# EAGLE design Adafruit BNO055 (EAGLE 9.3.1)
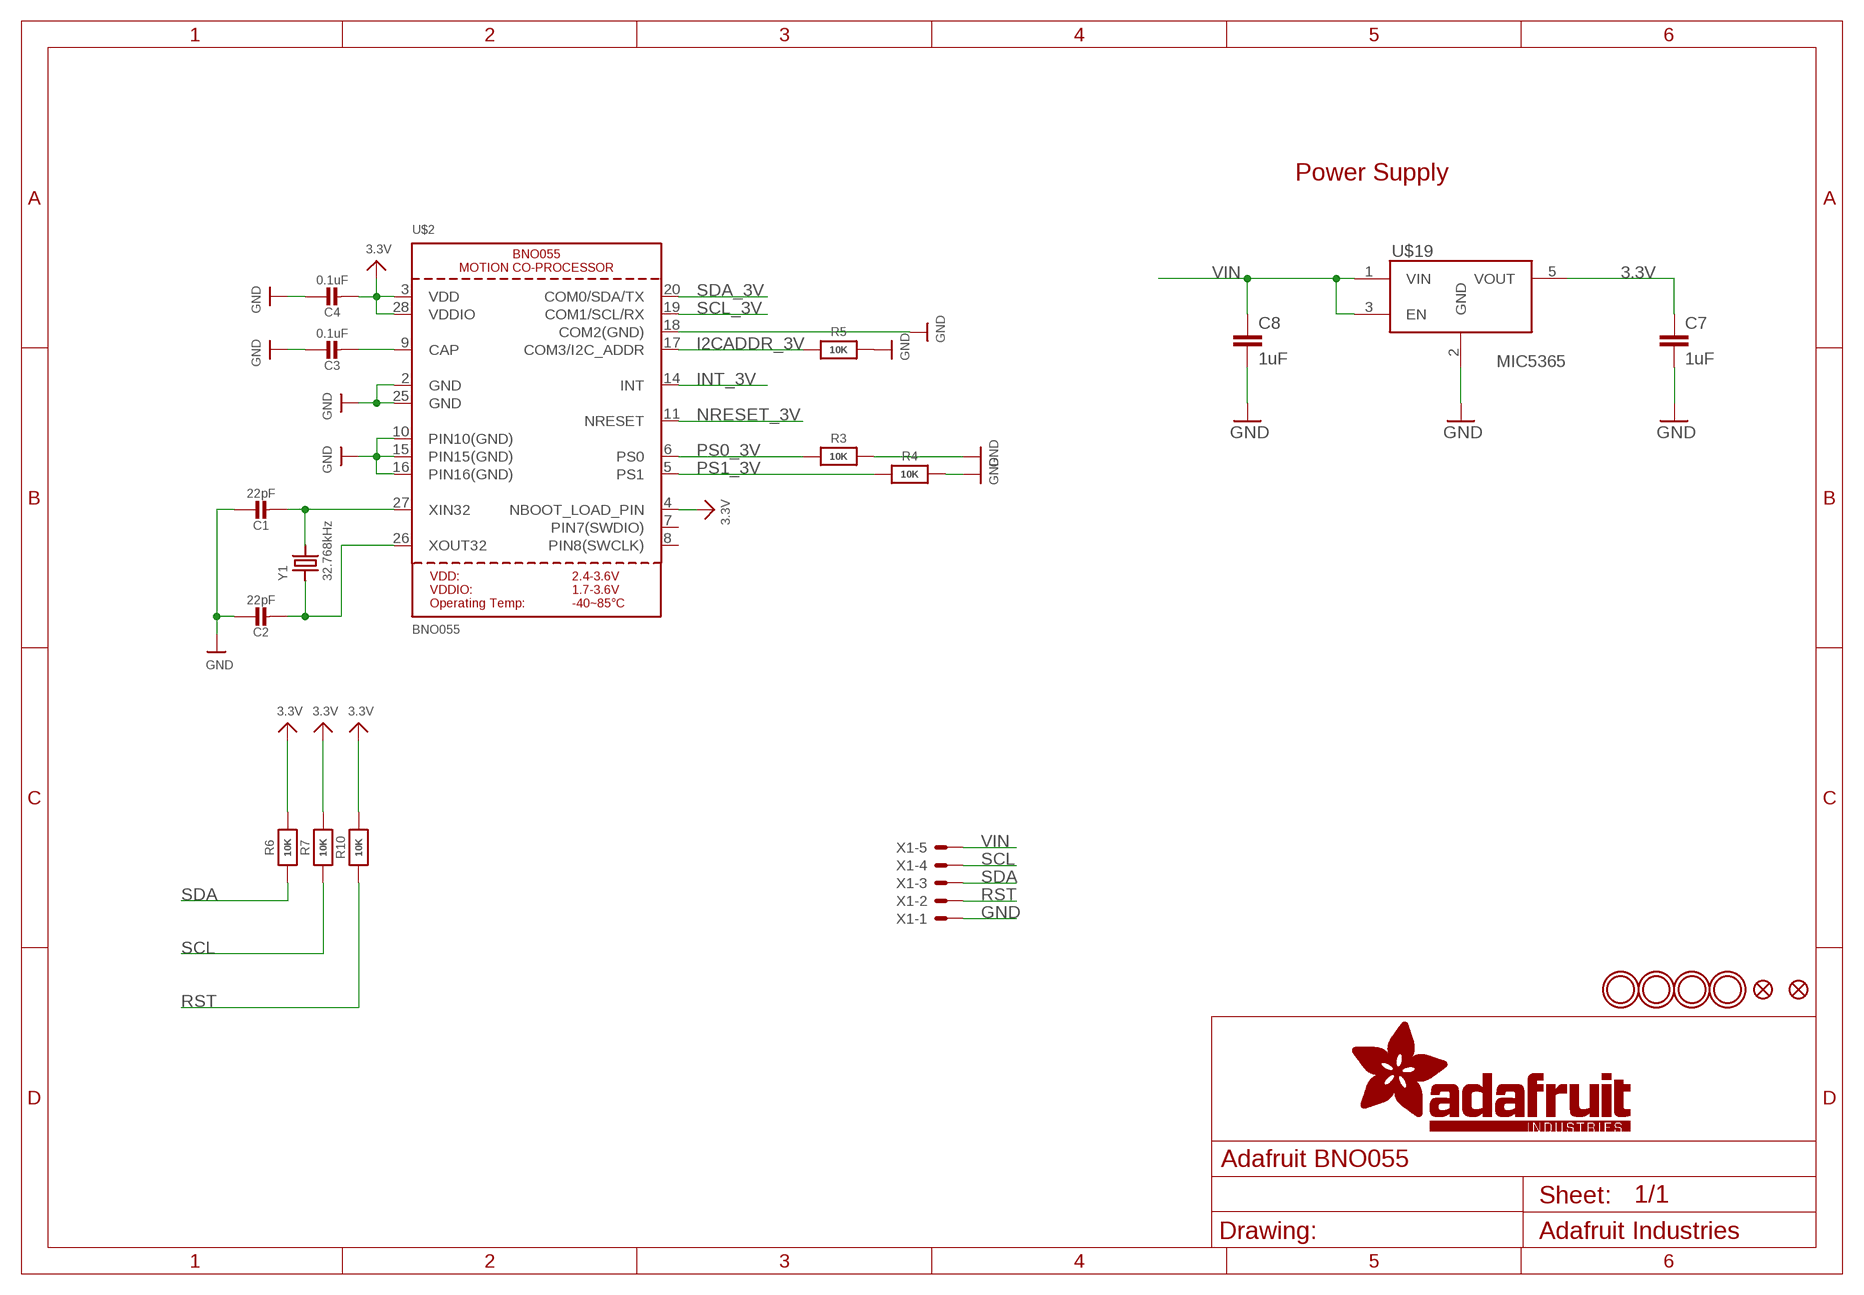
[diagram p0: schematic, sheet 1]

## Parts
C1  22pF  CAP_CERAMIC0805-NOOUTLINE  [0805-NO]
C2  22pF  CAP_CERAMIC0805-NOOUTLINE  [0805-NO]
C3  0.1uF  CAP_CERAMIC0805-NOOUTLINE  [0805-NO]
C4  0.1uF  CAP_CERAMIC0805_10MGAP  [0805_10MGAP]
C7  1uF  C-EUC0402  [C0402]
C8  1uF  C-EUC0402  [C0402]
FID1  FIDUCIAL""  [FIDUCIAL_1MM]
FID2  FIDUCIAL""  [FIDUCIAL_1MM]
R3  10K  RESISTOR0805_NOOUTLINE  [0805-NO]
R4  10K  RESISTOR0805_NOOUTLINE  [0805-NO]
R5  10K  RESISTOR0805_NOOUTLINE  [0805-NO]
R6  10K  RESISTOR0805_NOOUTLINE  [0805-NO]
R7  10K  RESISTOR0805_NOOUTLINE  [0805-NO]
R10  10K  RESISTOR0805_NOOUTLINE  [0805-NO]
U$2  BNO055  [BNO055]
U$19  VREG-MIC5365  [SC70-5L]
U$29  MOUNTINGHOLE2.5_THICK  [MOUNTINGHOLE_2.5_PLATED_THICK]
U$30  MOUNTINGHOLE2.5_THICK  [MOUNTINGHOLE_2.5_PLATED_THICK]
U$31  MOUNTINGHOLE2.5_THICK  [MOUNTINGHOLE_2.5_PLATED_THICK]
U$32  MOUNTINGHOLE2.5_THICK  [MOUNTINGHOLE_2.5_PLATED_THICK]
X1  JST-XH-05-PIN-LONG-PAD  [JST-XH-05-PACKAGE-LONG-PAD]
Y1  32.768kHz  CRYSTAL8.0X3.8  [CRYSTAL_8X3.8]

## Nets
3.3V: C4.2 C7.1 R6.2 R7.2 R10.2 U$2.3(VDD) U$2.4(NBOOT_LOAD_PIN) U$2.28(VDDIO) U$19.5(VOUT)
GND: C1.1 C2.1 C3.1 C4.1 C7.2 C8.2 R3.2 R4.2 R5.2 U$2.2(GND) U$2.10(PIN10(GND)) U$2.15(PIN15(GND)) U$2.16(PIN16(GND)) U$2.18(COM2(GND)) U$2.25(GND) U$19.2(GND) X1.1
I2CADDR_3V: R5.1 U$2.17(COM3/I2C_ADDR)
INT_3V: U$2.14(INT)
N$1: C1.2 U$2.27(XIN32) Y1.P$4
N$2: C2.2 U$2.26(XOUT32) Y1.P$1
N$3: C3.2 U$2.9(CAP)
NRESET_3V: U$2.11(NRESET)
PS0_3V: R3.1 U$2.6(PS0)
PS1_3V: R4.1 U$2.5(PS1)
RST: R10.1 X1.2
SCL: R7.1 X1.4
SCL_3V: U$2.19(COM1/SCL/RX)
SDA: R6.1 X1.3
SDA_3V: U$2.20(COM0/SDA/TX)
VIN: C8.1 U$19.1(VIN) U$19.3(EN) X1.5
Unconnected: U$2.7(PIN7(SWDIO)) U$2.8(PIN8(SWCLK))

## Notes on the sheet
- Power Supply
- MIC5365

## Library data of the parts
C1-C4 = microbuilder:CAP_CERAMIC: Ceramic Capacitors For new designs, use the packages preceded by an '_' character since they are more reliable: The following footprints should be used on most boards: _0402 - Standard footprint for regular board layouts _0603 - Standard footprint for regular board layouts _0805 - Standard footprint for regular board layouts _1206 - Standard footprint for regular board layouts For extremely tight-pitch boards where space is at a premium, the following 'micro-pitch' footprints can be used (smaller pads, no silkscreen outline, etc.): _0402MP - Micro-pitch footprint for very dense/compact boards _0603MP - Micro-pitch footprint for very dense/compact boards _0805MP - Micro-pitch footprint for very dense/compact boards _1206MP - Micro-pitch footprint for very dense/compact boards
C7 C8 = resistor:C-EU: CAPACITOR, European symbol
FID1 FID2 = microbuilder:FIDUCIAL: Fiducial Alignment Points Various fiducial points for machine vision alignment.; BOM: EXCLUDE
R3-R7 R10 = microbuilder:RESISTOR: Resistors For new designs, use the packages preceded by an '_' character since they are more reliable: The following footprints should be used on most boards: _0402 - Standard footprint for regular board layouts _0603 - Standard footprint for regular board layouts _0805 - Standard footprint for regular board layouts _1206 - Standard footprint for regular board layouts For extremely tight-pitch boards where space is at a premium, the following 'micro-pitch' footprints can be used (smaller pads, no silkscreen outline, etc.): _0402MP - Micro-pitch footprint for very dense/compact boards _0603MP - Micro-pitch footprint for very dense/compact boards _0805MP - Micro-pitch footprint for very dense/compact boards _1206MP - Micro-pitch footprint for very dense/compact boards
U$2 = microbuilder:BNO055: BNO055 - Motion Co-Processor
U$19 = BlueRobotics-Main:VREG-MIC5365
U$29-U$32 = microbuilder:MOUNTINGHOLE: Mounting Hole For #2 screws (0.086"/2.18mm width, 0.094"/2.4mm hole) use 2.5mm; BOM: EXCLUDE
X1 = Rembrandt Electronics - JST XH Connectors v1-0:JST-XH-05-PIN: JST XH Connector 2 Pin Wire to board connector. Pitch: 2,54 mm, (0.100") Number of pins: 5 Created by Rembrandt Electronics www.rembrandtelectronics.com
Y1 = microbuilder:CRYSTAL: Crystals HC49UP - Surface Mount Crystal 4.0MHz 18pF +/-30ppm Surface Mount Crystal [Digikey: 535-9857-1-ND] 12.0 MHz Surface Mount Crystal [Digikey: 535-9869-6-ND] 25.0 MHz Surface Mount Crystal [Digikey: 535-9078-1-ND] 2.5 x 2.0mm - MEMs SMT Crystal 16.0 MHz 10pF 20ppm 2.5 x 2.0mm Crystal [Digikey -40-85°C: 535-10923-1-ND] 3.2 x 2.5mm - MEMs SMT Crystal 12.0 MHz 8pF 15ppm 3.2 x 2.5mm Crystal [Digikey: -10-70°C: 644-1047-1-ND -40-125°C: 644-1128-1-ND] 40~85°C cheaper: 644-1173-6-ND 16.0 MHz 8pF 15ppm 3.2 x 2.5mm Crystal [Digikey: -10-70°C: 644-1049-1-ND -40-125°C: 644-1129-2-ND]-40~85°C cheaper: 644-1175-6-ND 16.0 MHz 10pF 10ppm 3.2 x 2.5mm Crystal [Digikey: 644-1100-1-ND] 27.12 MHz 18pF 30ppm 3.2 x 2.5mm Crystal [Digikey: 887-1424-1-ND] 27.12MHz 10pF 10ppm 3.2 x 2.5mm Crystal [Digikey: 887-1329-1-ND] 4.9 x 1.8mm - MEMs SMT Crystal 32.768 KHz 12.5pF 20ppm 4.9 x 1.8mm Crystal [Digikey: SE2415CT-ND] 8.0 x 3.8mm - Surface Mount Crystal 32.768kHz 12.5pF 20ppm -40°C-85°C [Digikey: 535-9166-2-ND] Cylinder 32.768KHz Cylinder Crystal (2x6mm body) [Ex. Digikey: 300-8341-2-ND]

## Board
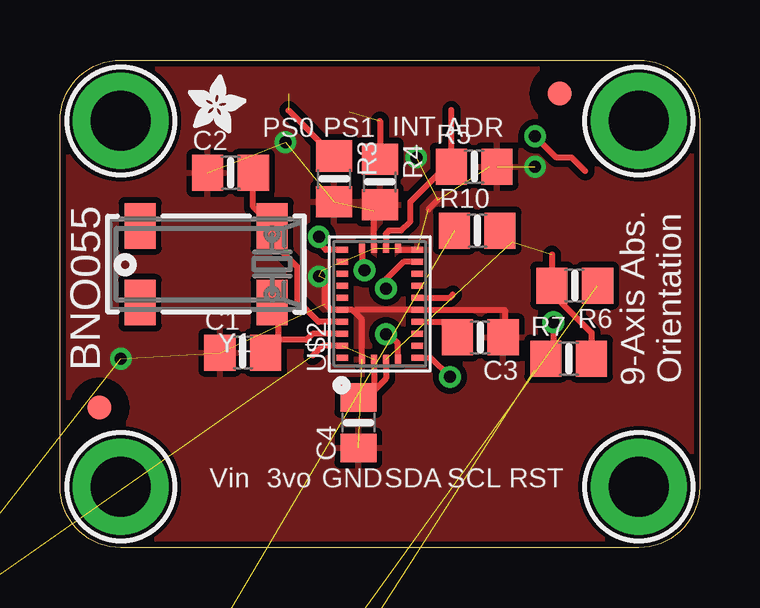
[diagram p1: board, top side]
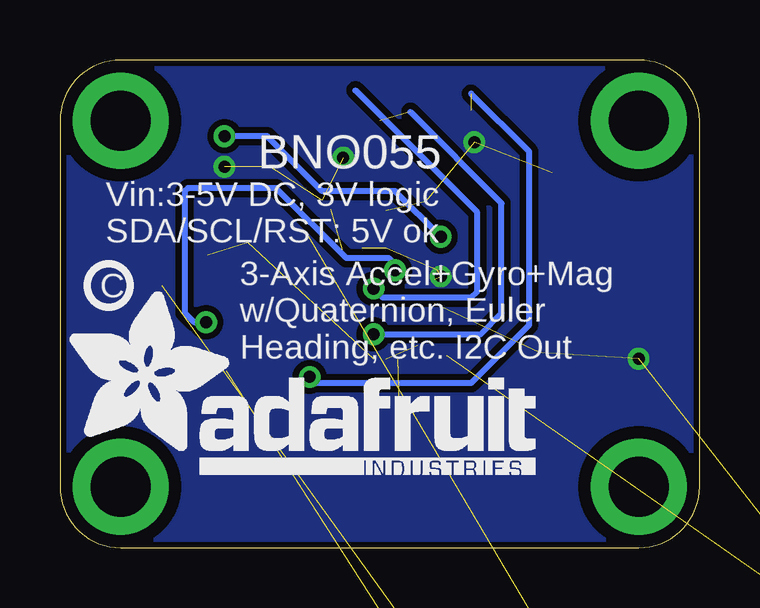
[diagram p2: board, bottom side, seen from below]

Size 26.67 x 20.32 mm. Coordinates in mm from the lower left corner, seen from the top.
Outline: 2.54,20.32 24.13,20.32 arc-90 26.67,17.78 26.67,2.54 arc-90 24.13,0 2.54,0 arc-90 0,2.54 0,17.78 arc-90 2.54,20.32
Copper layers (1*16): Top 0.035mm / dielectric 1.5mm / Bottom 0.035mm
Design rules "adafruit *": minimum track width 8mil, minimum drill 15.5mil, track to track 8mil, track to pad 8mil, pad to pad 8mil, via to via 8mil, smd to smd 8mil, copper to edge 10mil, drill to drill 8mil, minimum pad ring 10mil, minimum via ring 8mil, stop-mask expansion 2mil, vias tented up to drill 20mil, thermal gap 10mil

### Footprints (pad centres in the part's own frame; a part is rotated, then mirrored left to right if it is on the bottom)
0805-NO = smd 1.3 x 1.5: 1 -0.95,0; 2 0.95,0
0805_10MGAP = smd 1.2 x 1.5: 1 -1.05,0; 2 1.05,0
C0402 = smd 0.7 x 0.9: 1 -0.65,0; 2 0.65,0
FIDUCIAL_1MM = smd 1 x 1: 1 0,0
BNO055 = smd 0.25 x 0.475: 1 -2.25,1.562; 6 -2.25,-1.562; 7 -1.75,-1.562; 8 -1.25,-1.562; 9 -0.75,-1.562; 10 -0.25,-1.562; 11 0.25,-1.562; 12 0.75,-1.562; 13 1.25,-1.562; 14 1.75,-1.562; 15 2.25,-1.562; 20 2.25,1.562; 21 1.75,1.562; 22 1.25,1.562; 23 0.75,1.562; 24 0.25,1.562; 25 -0.25,1.562; 26 -0.75,1.562; 27 -1.25,1.562; 28 -1.75,1.562 | smd 0.375 x 0.25: 2 -2.312,0.75; 3 -2.312,0.25; 4 -2.312,-0.25; 5 -2.312,-0.75; 16 2.312,-0.75; 17 2.312,-0.25; 18 2.312,0.25; 19 2.312,0.75
SC70-5L = smd 0.4 x 0.8: 1 -0.65,-0.95; 2 0,-0.95; 3 0.65,-0.95; 4 0.65,0.95; 5 -0.65,0.95
MOUNTINGHOLE_2.5_PLATED_THICK = drill 2.5 pad 4: P$1 0,0
JST-XH-05-PACKAGE-LONG-PAD = drill 1.016 long: 1 -5.08,0; 2 -2.54,0; 3 0,0; 4 2.54,0; 5 5.08,0
CRYSTAL_8X3.8 = smd 1.3 x 1.9: P$1 -2.75,-1.6; P$2 2.75,-1.6; P$3 2.75,1.6; P$4 -2.75,1.6

### Placement (x,y rotation side)
C1  7.62,8.13 0 top
C2  7.11,15.62 0 top
C3  17.53,8.76 180 top
C4  12.45,5.21 90 top
C7  -12.45,-12.45 0 top  (outside the outline)
C8  -7.87,-12.45 0 top  (outside the outline)
FID1  20.83,18.92 0 top
FID2  1.65,5.84 0 top
R3  11.43,15.37 270 top
R4  13.34,15.24 270 top
R5  17.27,15.88 0 top
R6  21.46,10.92 180 top
R7  21.21,7.87 0 top
R10  17.4,13.21 0 top
U$2  13.34,10.16 90 top
U$3  [PCBFEAT-REV-040]  24.64,10.92 0 bottom
U$19  -10.92,-8.38 0 top  (outside the outline)
U$28  [ADAFRUIT_TEXT_20MM]  26.42,3.05 0 bottom
U$29  2.54,17.78 0 top
U$30  2.54,2.54 0 top
U$31  24.13,17.78 0 top
U$32  24.13,2.54 0 top
U$33  [ADAFRUIT_2.5MM]  5.33,17.27 0 top
X1  -4.32,-26.16 0 top  (outside the outline)
Y1  6.1,11.81 180 top

### Tracks (layer width: path | path; a pad name or v marks a point on that pad's centre or on a via)
3.3V  (5 unrouted)
  Top 0.254: U$2.3 13.09,6.55 | U$2.4 13.59,7.05 13.09,6.55 | U$2.28 10.95,8.41 10.54,8 | 22.03,7.75 R7.2 | R10.2 18.84,12.72 | 20.51,12.21 R6.2 20.51,10.6 22.16,8.96 R7.2 | 12.32,6.38 C4.2 12.8,6.26 13.09,6.55 | R7.2 21.65,7.37
GND  (via drill 0.5)  (18 unrouted)
  Top 0.254: U$2.2 12.59,9.51 12.26,9.84 | 12.26,9.84 12.19,9.91 U$2.25 11.3,9.91 11.05,10.16 11.05,11.18 | U$2.18 13.09,14.04 R4.2 | U$2.16 14.15,12.41 U$2.15 | C3.1 18.54,8.83 18.54,9.91 U$2.10 12.32,9.91 12.26,9.84 | 15.37,14.1 15.75,14.48 | 17.91,15.88 R5.2
  Bottom 0.254: 10.92,11.56 10.79,11.68
  other vias: 2.54,7.87 9.4,16.89 19.81,15.88 10.79,11.3 14.86,16.26
  pour Bottom (isolate 0.254): 0,20.32 26.67,20.32 26.67,0 0,0
  pour Top (isolate 0.254): 0,20.32 26.67,20.32 26.67,0 0,0
I2CADDR_3V
  Top 0.254: U$2.17 13.59,13.08 13.72,13.21 14.22,13.21 14.61,13.59 14.61,14.41 16.07,15.88 R5.1 16.32,18.23
INT_3V  (via drill 0.5)
  Top 0.254: U$2.14 14.32,11.91 13.59,11.18 v13.59,10.79
  Bottom 0.254: v13.59,10.79 13.21,10.41 9.53,10.41 9.27,10.67 9.27,13.97 14.35,19.05
N$1
  Top 0.254: U$2.27 10.53,8.91 10.28,8.66 9.1,8.66 | 9.1,8.66 C1.2 | Y1.P$4 9.1,9.96 9.1,8.66
N$2
  Top 0.254: U$2.26 10.78,9.41 9.91,10.29 9.91,11.68 8.85,12.74 Y1.P$1 8.06,14.2 C2.2
N$3
  Top 0.254: U$2.9 15.93,9.41 C3.2
NRESET_3V
  Top 0.254: U$2.11 16.25,10.41 16.38,10.54
PS0_3V  (via drill 0.5)  (1 unrouted)
  Top 0.254: 9.53,18.22 R3.1 | U$2.6 15.46,7.91 v16.26,7.11
  Bottom 0.254: 9.53,18.92 7.11,16.51 7.11,9.27 9.53,6.86 16,6.86 v16.26,7.11
PS1_3V  (via drill 0.5)  (1 unrouted)
  Top 0.254: 13.34,17.78 R4.1 | U$2.5 14.09,8.52 13.72,8.89 v13.59,8.89
  Bottom 0.254: v13.59,8.89 9.14,8.89 8.26,9.78 8.26,14.35 12.06,18.16
RST  (1 unrouted)
  Top 0.254: R10.1 16.38,13.27
SCL  (1 unrouted)
  Top 0.254: R7.1 19.75,7.37
SCL_3V  (via drill 0.5)
  Top 0.254: U$2.19 12.59,11.67 v12.7,11.56 | v20.57,9.4 20.57,7.94 20.51,7.87
  Bottom 0.254: v12.7,11.56 12.7,11.81 12.95,12.06 14.73,12.06 17.65,14.99 21.34,14.99 21.46,14.86 21.46,9.78 21.08,9.4 v20.57,9.4
SDA  (1 unrouted)
  Top 0.254: R6.1 21.91,11.43
SDA_3V  (via drill 0.5)
  Top 0.254: U$2.20 11.09,12.41 10.79,12.7 v10.79,12.95 | 21.91,15.69 21.34,16.26 20.7,16.26 v19.81,17.14
  Bottom 0.254: v10.79,12.95 12.7,14.86 15.75,14.86 18.03,17.14 v19.81,17.14
VIN  (3 unrouted)

### Text on the board
tPlace: PS0 | PS1 | INT | ADR | BNO055 | 9-Axis Abs. / Orientation | Vin | 3vo | GND | SDA | SCL | RST
bPlace: BNO055 | Vin:3-5V DC, 3V logic / SDA/SCL/RST: 5V ok | 3-Axis Accel+Gyro+Mag / w/Quaternion, Euler / Heading, etc. I2C Out